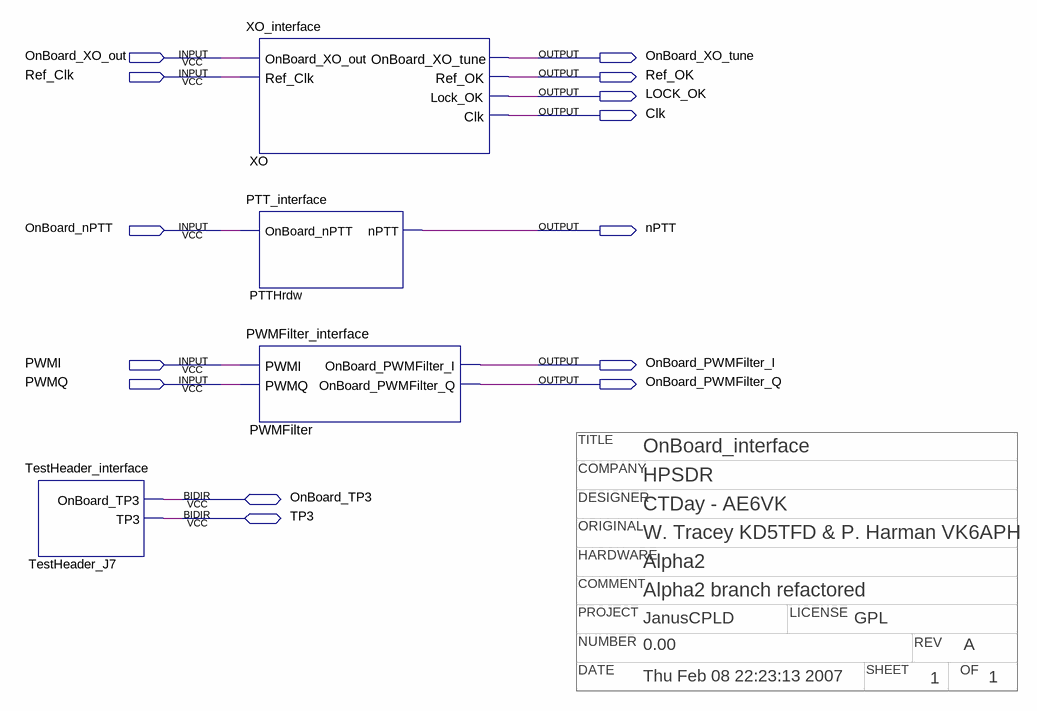
[diagram p0: schematic sheet]
// Quartus schematic OnBoard_interface.bdf as structural Verilog: 4 symbols, 14 pins
// Title block: TITLE: OnBoard_interface; COMPANY: HPSDR; DESIGNER: CTDay - AE6VK; NUMBER: 0.00; REV: A; DATE: Thu Feb 08 22:23:13 2007; SHEET: 1; OF: 1; ORIGINAL: W. Tracey KD5TFD & P. Harman VK6APH; HARDWARE: Alpha2; COMMENT: Alpha2 branch refactored; PROJECT: JanusCPLD; LICENSE: GPL
module OnBoard_interface (
  input  OnBoard_XO_out,
  input  Ref_Clk,
  input  OnBoard_nPTT,
  input  PWMI,
  input  PWMQ,
  inout  OnBoard_TP3,
  inout  TP3,
  output OnBoard_XO_tune,
  output Ref_OK,
  output LOCK_OK,
  output Clk,
  output nPTT,
  output OnBoard_PWMFilter_I,
  output OnBoard_PWMFilter_Q
);

  TestHeader_interface TestHeader_J7 (.OnBoard_TP3(OnBoard_TP3), .TP3(TP3));
  XO_interface XO (
    .OnBoard_XO_out(OnBoard_XO_out), .Ref_Clk(Ref_Clk), .OnBoard_XO_tune(OnBoard_XO_tune), .Ref_OK(Ref_OK),
    .Lock_OK(LOCK_OK), .Clk(Clk));
  PTT_interface PTTHrdw (.OnBoard_nPTT(OnBoard_nPTT), .nPTT(nPTT));
  PWMFilter_interface PWMFilter (
    .PWMI(PWMI), .PWMQ(PWMQ), .OnBoard_PWMFilter_I(OnBoard_PWMFilter_I),
    .OnBoard_PWMFilter_Q(OnBoard_PWMFilter_Q));
endmodule
